# EAGLE design FiveToggleBreakout (EAGLE 6.5.0)
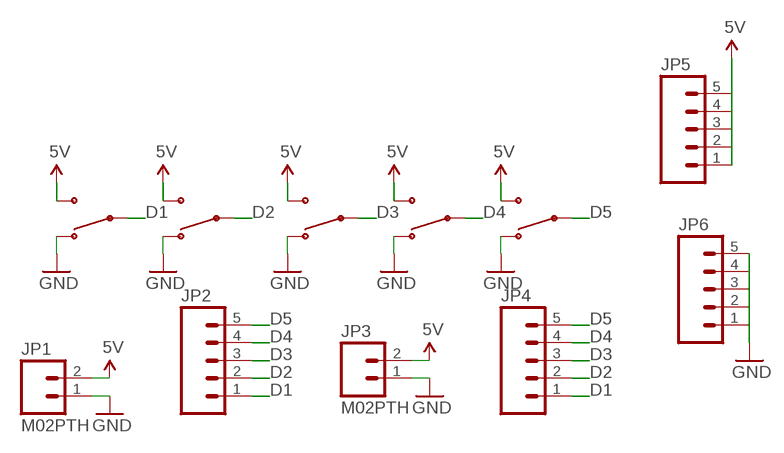
[diagram p0: schematic, sheet 1]

## Parts
JP1  M02PTH  [1X02]
JP2  M05PTH  [1X05]
JP3  M02PTH  [1X02]
JP4  M05PTH  [1X05]
JP5  M05PTH  [1X05]
JP6  M05PTH  [1X05]
U$1  SPDTSPDT  [TOGGLE_SPDT]
U$2  SPDTSPDT  [TOGGLE_SPDT]
U$3  SPDTSPDT  [TOGGLE_SPDT]
U$4  SPDTSPDT  [TOGGLE_SPDT]
U$5  SPDTSPDT  [TOGGLE_SPDT]

## Nets
5V: JP1.2 JP3.2 JP5.1 JP5.2 JP5.3 JP5.4 JP5.5 U$1.3 U$2.3 U$3.3 U$4.3 U$5.3
D1: JP2.1 JP4.1 U$1.2
D2: JP2.2 JP4.2 U$2.2
D3: JP2.3 JP4.3 U$3.2
D4: JP2.4 JP4.4 U$4.2
D5: JP2.5 JP4.5 U$5.2
GND: JP1.1 JP3.1 JP6.1 JP6.2 JP6.3 JP6.4 JP6.5 U$1.1 U$2.1 U$3.1 U$4.1 U$5.1

## Library data of the parts
JP1 JP3 = SparkFun-Connectors:M02: Standard 2-pin 0.1" header. Use with - straight break away headers ( PRT-00116) - right angle break away headers (PRT-00553) - swiss pins (PRT-00743) - machine pins (PRT-00117) - female headers (PRT-00115) Molex polarized connector foot print use with: PRT-08233 with associated crimp pins and housings. 2.54_SCREWTERM for use with PRT-10571. 3.5mm Screw Terminal footprints for PRT-08084 5mm Screw Terminal footprints for use with PRT-08433
JP2 JP4-JP6 = SparkFun-Connectors:M05: Header 5 Standard 5-pin 0.1" header. Use with straight break away headers (SKU : PRT-00116), right angle break away headers (PRT-00553), swiss pins (PRT-00743), machine pins (PRT-00117), and female headers (PRT-00115). Molex polarized connector foot print use with SKU : PRT-08230 with associated crimp pins and housings.
U$1-U$5 = barbary_enterprises:SPDT

## Board
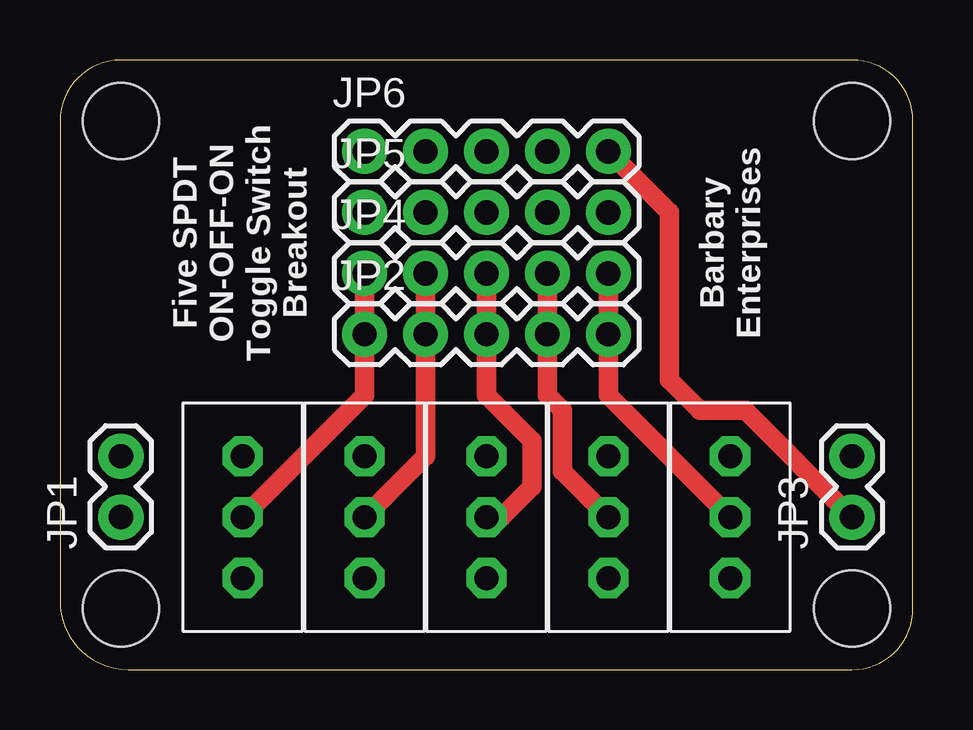
[diagram p1: board, top side]
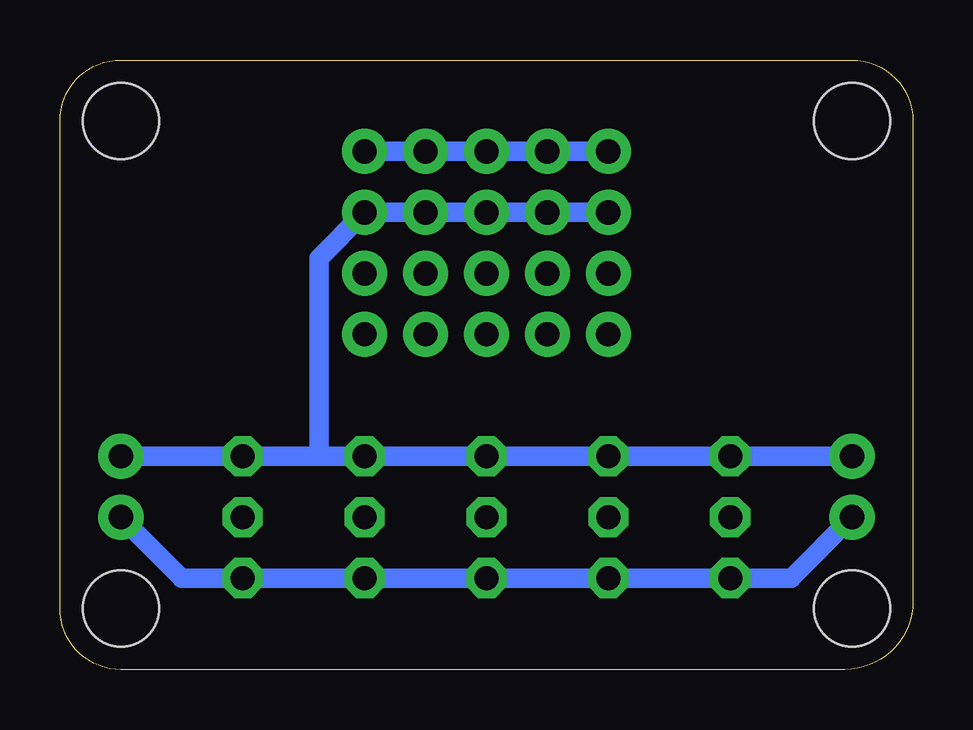
[diagram p2: board, bottom side, seen from below]

Size 35.56 x 25.4 mm. Coordinates in mm from the lower left corner, seen from the top.
Outline: 35.56,2.54 35.56,22.86 arc90 33.02,25.4 2.54,25.39 arc90 0,22.85 0,2.84 arc90 2.84,0 33.02,0 arc90 35.56,2.54
Copper layers (1*16): Top 0.0356mm / dielectric 1.5011mm / Bottom 0.0356mm
Design rules "LaenPCBOrder": minimum track width 6mil, minimum drill 13mil, track to track 6mil, track to pad 6mil, pad to pad 6mil, via to via 6mil, smd to smd 6mil, copper to edge 15mil, drill to drill 6mil, minimum pad ring 7mil, minimum via ring 7mil, stop-mask expansion 3mil, vias tented up to drill 0mil, thermal gap 10mil
Holes 3.17 mm at 2.54,2.54 2.54,22.86 33.02,22.86 33.02,2.54

### Footprints (pad centres in the part's own frame; a part is rotated, then mirrored left to right if it is on the bottom)
1X02 = drill 1.016 pad 1.88: 1 0,0; 2 2.54,0
1X05 = drill 1.016 pad 1.88: 1 0,0; 2 2.54,0; 3 5.08,0; 4 7.62,0; 5 10.16,0
TOGGLE_SPDT = drill 1 pad 1.676 octagon: 1 0,2.54; 2 0,0; 3 0,-2.54

### Placement (x,y rotation side)
JP1  2.54,6.35 90 top
JP2  12.7,13.97 0 top
JP3  33.02,6.35 90 top
JP4  12.7,16.51 0 top
JP5  12.7,19.05 0 top
JP6  12.7,21.59 0 top
U$1  7.62,6.35 180 top
U$2  12.7,6.35 180 top
U$3  17.78,6.35 180 top
U$4  22.86,6.35 180 top
U$5  27.94,6.35 180 top

### Tracks (layer width: path | path; a pad name or v marks a point on that pad's centre or on a via)
5V
  Bottom 0.813: JP1.2 U$1.3 U$2.3 U$3.3 U$4.3 24.77,8.89 | 24.77,8.89 U$5.3 JP3.2 | JP5.1 JP5.2 JP5.3 JP5.4 JP5.5 24.77,17.14 24.77,8.89
D1
  Top 0.813: U$1.2 12.7,11.43 JP2.1 JP4.1
D2
  Top 0.813: U$2.2 15.24,8.89 JP2.2 JP4.2
D3
  Top 0.813: U$3.2 18.41,6.35 19.68,7.62 19.68,9.53 17.78,11.43 JP2.3 JP4.3
D4
  Top 0.813: U$4.2 20.95,8.26 20.95,10.79 20.32,11.43 JP2.4 JP4.4
D5
  Top 0.813: U$5.2 22.86,11.43 JP2.5 JP4.5
GND
  Top 0.813: JP6.5 25.4,19.05 25.4,12.06 26.67,10.79 28.57,10.79 JP3.1
  Bottom 0.813: JP1.1 5.08,3.81 U$1.1 U$2.1 U$3.1 U$4.1 U$5.1 30.48,3.81 JP3.1 | JP6.5 JP6.4 JP6.3 JP6.2 JP6.1

### Text on the board
tPlace: Five SPDT / ON-OFF-ON / Toggle Switch / Breakout | Barbary / Enterprises